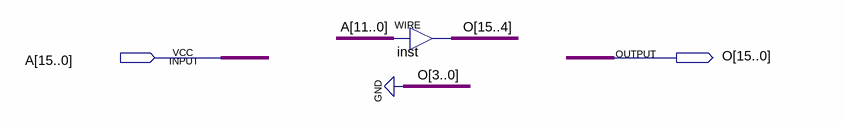
[diagram p0: schematic sheet]
// Quartus schematic sllll.bdf as structural Verilog: 1 symbols, 2 pins
module sllll (
  input  [15:0] A,
  output [15:0] O
);

  assign O[15:4] = A[11:0];  // WIRE inst

  assign O[3:0] = 4'b0000;
endmodule
